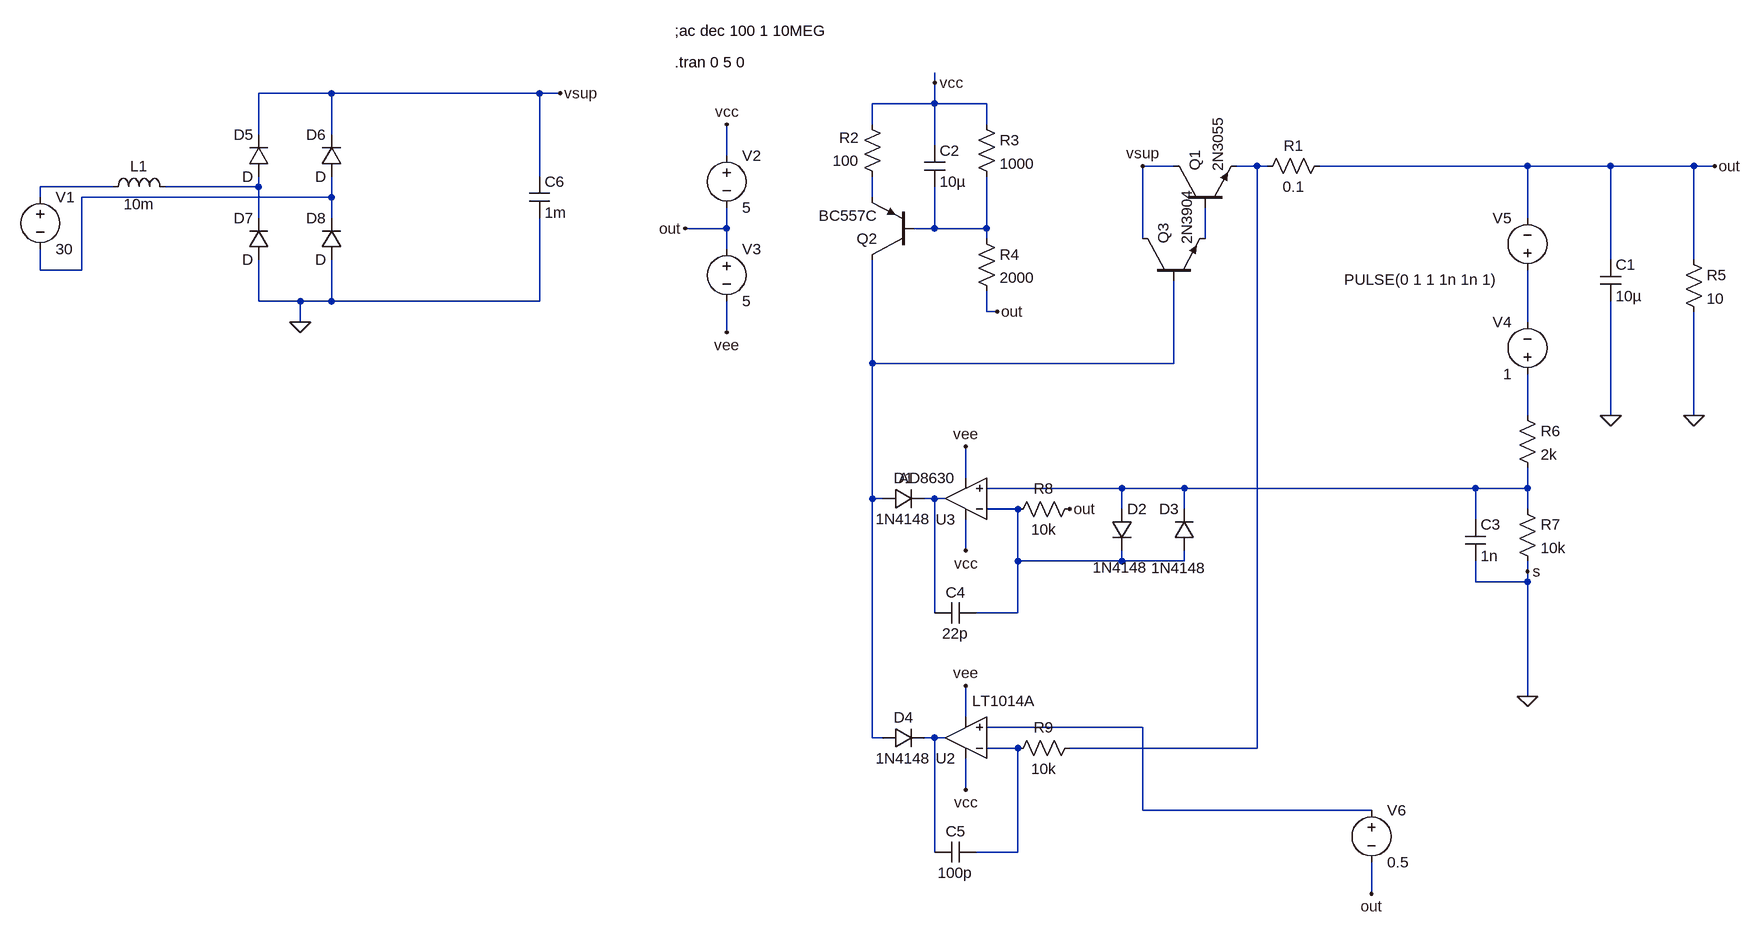
[diagram p0: schematic transient.asc]
transient.asc, the LTspice schematic file:
Version 4
SHEET 1 1080 1268
WIRE -176 -64 -176 -80
WIRE -1104 -48 -1216 -48
WIRE -784 -48 -1104 -48
WIRE -752 -48 -784 -48
WIRE -176 -32 -176 -64
WIRE -176 -32 -272 -32
WIRE -96 -32 -176 -32
WIRE -272 0 -272 -32
WIRE -96 0 -96 -32
WIRE -1216 16 -1216 -48
WIRE -1104 16 -1104 -48
WIRE -176 32 -176 -32
WIRE -496 48 -496 0
WIRE 192 64 144 64
WIRE 320 64 288 64
WIRE 336 64 320 64
WIRE 736 64 416 64
WIRE 864 64 736 64
WIRE 992 64 864 64
WIRE 1024 64 992 64
WIRE -784 80 -784 -48
WIRE -1440 96 -1552 96
WIRE -1216 96 -1216 80
WIRE -1216 96 -1360 96
WIRE -1552 112 -1552 96
WIRE -1104 112 -1104 80
WIRE -1104 112 -1488 112
WIRE -272 112 -272 80
WIRE -1216 144 -1216 96
WIRE -1104 144 -1104 112
WIRE 736 144 736 64
WIRE -496 160 -496 128
WIRE -496 160 -560 160
WIRE -176 160 -176 96
WIRE -176 160 -208 160
WIRE -96 160 -96 80
WIRE -96 160 -176 160
WIRE -96 176 -96 160
WIRE 144 176 144 64
WIRE 240 176 240 128
WIRE -496 192 -496 160
WIRE 864 208 864 64
WIRE 992 208 992 64
WIRE -1552 224 -1552 192
WIRE -1488 224 -1488 112
WIRE -1488 224 -1552 224
WIRE -1216 272 -1216 208
WIRE -1152 272 -1216 272
WIRE -1104 272 -1104 208
WIRE -1104 272 -1152 272
WIRE -784 272 -784 144
WIRE -784 272 -1104 272
WIRE -96 288 -96 256
WIRE -80 288 -96 288
WIRE -1152 304 -1152 272
WIRE 736 304 736 224
WIRE -496 320 -496 272
WIRE -272 368 -272 208
WIRE 192 368 192 240
WIRE 192 368 -272 368
WIRE 736 448 736 384
WIRE 864 448 864 272
WIRE 992 448 992 288
WIRE -128 544 -128 496
WIRE 112 560 -96 560
WIRE 208 560 112 560
WIRE 656 560 208 560
WIRE 736 560 736 528
WIRE 736 560 656 560
WIRE -272 576 -272 368
WIRE -256 576 -272 576
WIRE -176 576 -192 576
WIRE -160 576 -176 576
WIRE -48 592 -96 592
WIRE 112 592 112 560
WIRE 208 592 208 560
WIRE 736 592 736 560
WIRE 656 608 656 560
WIRE -128 656 -128 608
WIRE -48 672 -48 592
WIRE 112 672 112 656
WIRE 112 672 -48 672
WIRE 208 672 208 656
WIRE 208 672 112 672
WIRE 736 688 736 672
WIRE 656 704 656 672
WIRE 736 704 736 688
WIRE 736 704 656 704
WIRE -176 752 -176 576
WIRE -48 752 -48 672
WIRE -48 752 -112 752
WIRE 736 880 736 704
WIRE -128 912 -128 864
WIRE 144 928 -96 928
WIRE -272 944 -272 576
WIRE -256 944 -272 944
WIRE -176 944 -192 944
WIRE -160 944 -176 944
WIRE -48 960 -96 960
WIRE 320 960 320 64
WIRE 320 960 32 960
WIRE -128 1024 -128 976
WIRE 144 1056 144 928
WIRE 496 1056 144 1056
WIRE -176 1120 -176 944
WIRE -48 1120 -48 960
WIRE -48 1120 -112 1120
WIRE 496 1184 496 1136
FLAG 1024 64 out
FLAG -80 288 out
FLAG -560 160 out
FLAG -496 320 vee
FLAG -496 0 vcc
FLAG -176 -64 vcc
FLAG 864 448 0
FLAG 992 448 0
FLAG -128 656 vcc
FLAG -128 496 vee
FLAG 736 880 0
FLAG 32 592 out
FLAG 736 688 s
FLAG -128 1024 vcc
FLAG -128 864 vee
FLAG 496 1184 out
FLAG 144 64 vsup
FLAG -752 -48 vsup
FLAG -1152 304 0
SYMBOL npn 192 128 R270
SYMATTR InstName Q1
SYMATTR Value 2N3055
SYMBOL res 432 48 R90
WINDOW 0 0 56 VBottom 2
WINDOW 3 32 56 VTop 2
SYMATTR InstName R1
SYMATTR Value 0.1
SYMBOL res -256 96 R180
WINDOW 0 36 76 Left 2
WINDOW 3 36 40 Left 2
SYMATTR InstName R2
SYMATTR Value 100
SYMBOL pnp -208 208 R180
SYMATTR InstName Q2
SYMATTR Value BC557C
SYMBOL res -112 -16 R0
SYMATTR InstName R3
SYMATTR Value 1000
SYMBOL res -112 160 R0
SYMATTR InstName R4
SYMATTR Value 2000
SYMBOL voltage -496 32 R0
WINDOW 123 0 0 Left 0
WINDOW 39 0 0 Left 0
SYMATTR InstName V2
SYMATTR Value 5
SYMBOL voltage -496 176 R0
WINDOW 123 0 0 Left 0
WINDOW 39 0 0 Left 0
SYMATTR InstName V3
SYMATTR Value 5
SYMBOL res 976 192 R0
SYMATTR InstName R5
SYMATTR Value 10
SYMBOL cap 848 208 R0
SYMATTR InstName C1
SYMATTR Value 10µ
SYMATTR SpiceLine Rser=2
SYMBOL diode -256 592 R270
WINDOW 0 32 32 VTop 2
WINDOW 3 0 32 VBottom 2
SYMATTR InstName D1
SYMATTR Value 1N4148
SYMBOL voltage 736 400 R180
WINDOW 0 24 96 Left 2
WINDOW 3 24 16 Left 2
WINDOW 123 0 0 Left 0
WINDOW 39 0 0 Left 0
SYMATTR InstName V4
SYMATTR Value 1
SYMBOL res 720 432 R0
SYMATTR InstName R6
SYMATTR Value 2k
SYMBOL res 720 576 R0
SYMATTR InstName R7
SYMATTR Value 10k
SYMBOL cap -192 32 R0
SYMATTR InstName C2
SYMATTR Value 10µ
SYMATTR SpiceLine Rser=2
SYMBOL cap 640 608 R0
SYMATTR InstName C3
SYMATTR Value 1n
SYMBOL cap -112 736 R90
WINDOW 0 0 32 VBottom 2
WINDOW 3 32 32 VTop 2
SYMATTR InstName C4
SYMATTR Value 22p
SYMATTR SpiceLine Rser=1
SYMBOL voltage 736 240 R180
WINDOW 0 24 96 Left 2
WINDOW 3 46 1 Left 2
WINDOW 123 46 29 Left 2
WINDOW 39 0 0 Left 0
SYMATTR InstName V5
SYMATTR Value PULSE(0 1 1 1n 1n 1)
SYMBOL diode 96 592 R0
WINDOW 3 61 91 Left 2
SYMATTR Value 1N4148
SYMATTR InstName D2
SYMBOL diode 224 656 R180
WINDOW 0 24 64 Left 2
WINDOW 3 72 -26 Left 2
SYMATTR InstName D3
SYMATTR Value 1N4148
SYMBOL res 48 576 R90
WINDOW 0 0 56 VBottom 2
WINDOW 3 32 56 VTop 2
SYMATTR InstName R8
SYMATTR Value 10k
SYMBOL diode -256 960 R270
WINDOW 0 32 32 VTop 2
WINDOW 3 0 32 VBottom 2
SYMATTR InstName D4
SYMATTR Value 1N4148
SYMBOL cap -112 1104 R90
WINDOW 0 0 32 VBottom 2
WINDOW 3 32 32 VTop 2
SYMATTR InstName C5
SYMATTR Value 100p
SYMATTR SpiceLine Rser=1
SYMBOL res 48 944 R90
WINDOW 0 0 56 VBottom 2
WINDOW 3 32 56 VTop 2
SYMATTR InstName R9
SYMATTR Value 10k
SYMBOL OpAmps\\LT1014A -128 1008 R180
WINDOW 3 -108 121 Left 2
SYMATTR InstName U2
SYMBOL voltage 496 1040 R0
WINDOW 123 0 0 Left 0
WINDOW 39 0 0 Left 0
SYMATTR InstName V6
SYMATTR Value 0.5
SYMBOL npn 144 240 R270
SYMATTR InstName Q3
SYMATTR Value 2N3904
SYMBOL voltage -1552 96 R0
WINDOW 123 0 0 Left 0
WINDOW 39 0 0 Left 0
SYMATTR InstName V1
SYMATTR Value 30
SYMBOL diode -1200 80 R180
WINDOW 0 24 64 Left 2
WINDOW 3 24 0 Left 2
SYMATTR InstName D5
SYMBOL diode -1088 80 R180
WINDOW 0 24 64 Left 2
WINDOW 3 24 0 Left 2
SYMATTR InstName D6
SYMBOL diode -1200 208 R180
WINDOW 0 24 64 Left 2
WINDOW 3 24 0 Left 2
SYMATTR InstName D7
SYMBOL diode -1088 208 R180
WINDOW 0 24 64 Left 2
WINDOW 3 24 0 Left 2
SYMATTR InstName D8
SYMBOL cap -800 80 R0
SYMATTR InstName C6
SYMATTR Value 1m
SYMATTR SpiceLine Rser=1m
SYMBOL ind -1456 112 R270
WINDOW 0 32 56 VTop 2
WINDOW 3 5 56 VBottom 2
SYMATTR InstName L1
SYMATTR Value 10m
SYMATTR SpiceLine Rser=10m
SYMBOL OpAmps\\AD8630 -128 640 R180
SYMATTR InstName U3
TEXT -576 -144 Left 2 !;ac dec 100 1 10MEG
TEXT -576 -96 Left 2 !.tran 0 5 0

The netlist it stands for:
* transient.asc
Q1 vsup N007 N001 0 2N3055
R1 out N001 0.1
R2 N005 vcc 100
Q2 N009 N006 N005 0 BC557C
R3 vcc N006 1000
R4 N006 out 2000
V2 vcc out 5
V3 out vee 5
R5 out 0 10
C1 out 0 10µ Rser=2
D1 N009 N012 1N4148
V4 N010 N008 1
R6 N010 N011 2k
R7 N011 0 10k
C2 vcc N006 10µ Rser=2
C3 N011 0 1n
C4 N013 N012 22p Rser=1
V5 N008 out PULSE(0 1 1 1n 1n 1)
D2 N011 N013 1N4148
D3 N013 N011 1N4148
R8 out N013 10k
D4 N009 N015 1N4148
C5 N016 N015 100p Rser=1
R9 N001 N016 10k
XU2 N014 N016 vcc vee N015 LT1014A  ; pins In+ In- V+ V- OUT
V6 N014 out 0.5
Q3 vsup N009 N007 0 2N3904
V1 N002 N004 30
D5 N003 vsup D
D6 N004 vsup D
D7 0 N003 D
D8 0 N004 D
C6 vsup 0 1m Rser=1m
L1 N002 N003 10m Rser=10m
XU3 N011 N013 vcc vee N012 AD8630  ; pins In+ In- V+ V- OUT
.model D D
.lib standard.dio
.model NPN NPN
.model PNP PNP
.lib standard.bjt
;ac dec 100 1 10MEG
.tran 0 5 0
.backanno
.end